# Altium schematic sheet RC4558_2021-03-31.schdoc
size 243 x 219 mm
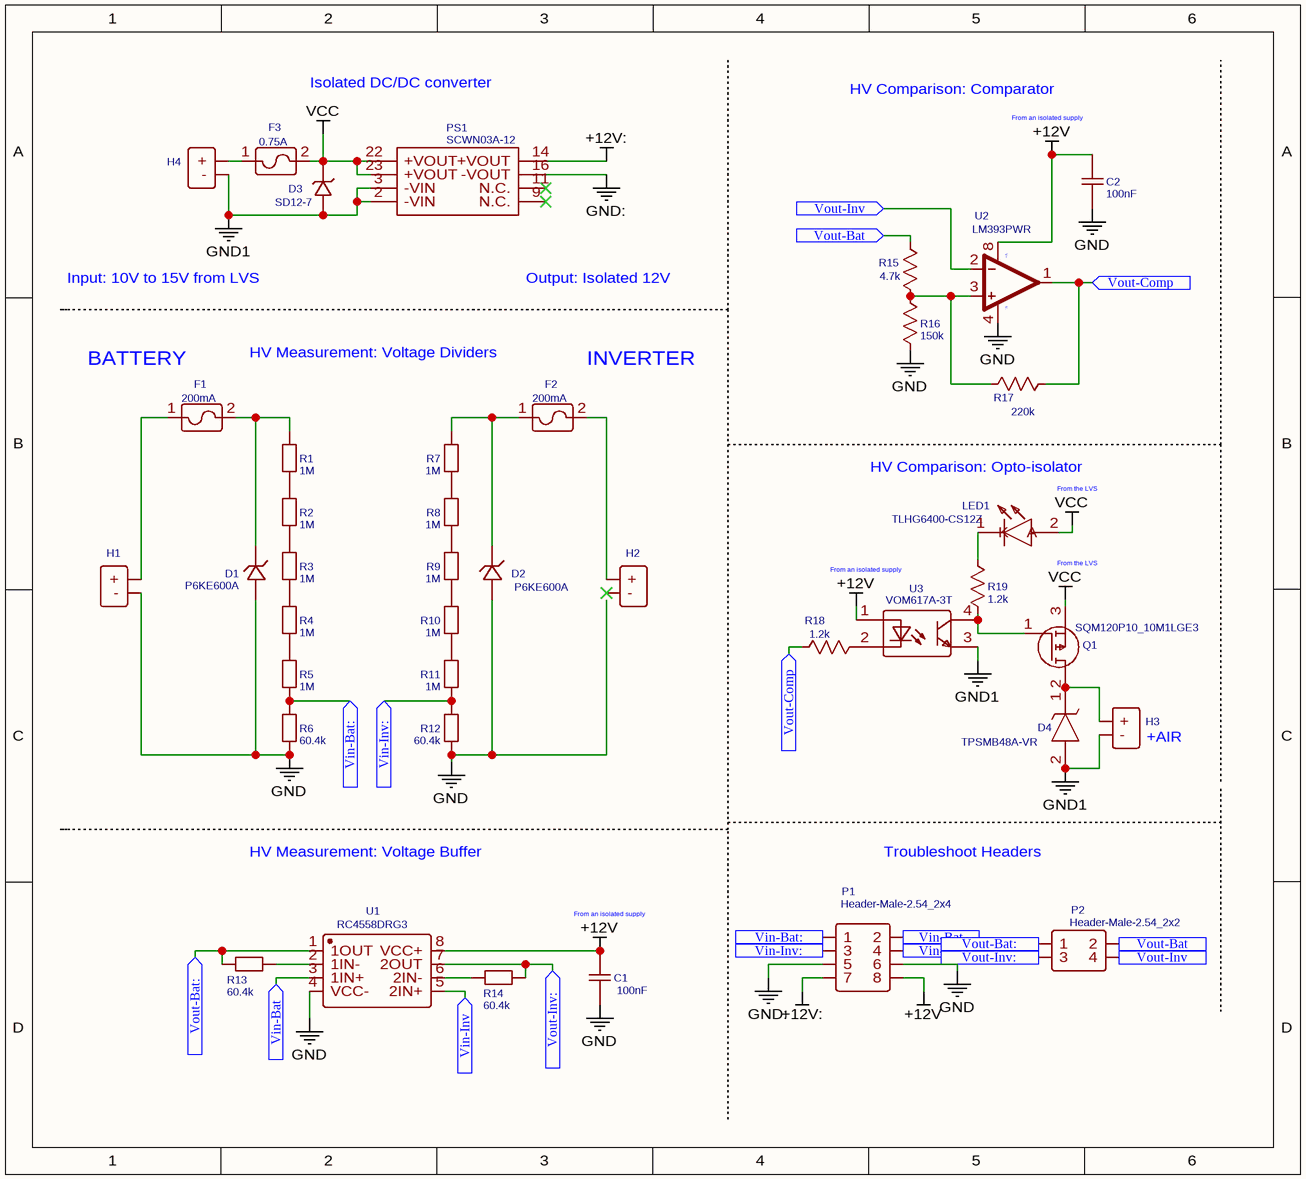
[diagram p0: RC4558_2021-03-31.schdoc]

## Parts
C1  100nF  [CAPC3216X94N]
C2  100nF  [CAPC3216X94N]
D1  P6KE600A  [DO-15_BD3.1-L6.7-P10.70-D0.9-RD]
D2  P6KE600A  [DO-15_BD3.1-L6.7-P10.70-D0.9-RD]
D3  SD12-7  [SOD-323_L1.8-W1.3-LS2.5-RD]
D4  TPSMB48A-VR  [DIONM5436X244N]
F1  200mA  [FUSE HOLDER]
F2  200mA  [FUSE HOLDER]
F3  0.75A  [2XFUSE_CLIP]
H1  1714971  [PHOENIX CONNECT 1714971 TERMINAL 2 POS]  (value not drawn)
H2  1714971  [PHOENIX CONNECT 1714971 TERMINAL 2 POS]  (value not drawn)
H3  1714971  [PHOENIX CONNECT 1714971 TERMINAL 2 POS]  (value not drawn)
H4  1714971  [PHOENIX CONNECT 1714971 TERMINAL 2 POS]  (value not drawn)
LED1  TLHG6400-CS12Z  [TLHG5400]
P1  Header-Male-2.54_2x4  [HDR-TH_8P-P2.54-V-M-R2-C4-S2.54]
P2  Header-Male-2.54_2x2  [HDR-TH_4P-P2.54-V-R2-C2-S2.54]
PS1  SCWN03A-12  [SCWN03A-12]
Q1  SQM120P10_10M1LGE3  [SQM120P10_10M1LGE3]
R1  1M  [RESC3216X70N]
R2  1M  [RESC3216X70N]
R3  1M  [RESC3216X70N]
R4  1M  [RESC3216X70N]
R5  1M  [RESC3216X70N]
R6  60.4k  [RESC3216X70N]
R7  1M  [RESC3216X70N]
R8  1M  [RESC3216X70N]
R9  1M  [RESC3216X70N]
R10  1M  [RESC3216X70N]
R11  1M  [RESC3216X70N]
R12  60.4k  [RESC3216X70N]
R13  60.4k  [RESC3216X70N]
R14  60.4k  [RESC3216X70N]
R15  4.7k  [RESC3216X70N]
R16  150k  [RESC3216X70N]
R17  220k  [RESC3216X70N]
R18  1.2k  [RESC3216X60N]
R19  1.2k  [RESC3116X70N]
U1  RC4558DRG3  [SOIC127P600X175-8N]
U2  LM393PWR  [SOP65P640X120-8N]
U3  VOM617A-3T  [VOM617A8X001T]

## Ports
Vin-Bat (in), Vin-Bat: (in), Vin-Inv (in), Vin-Inv: (in), Vout-Bat (in), Vout-Bat: (in), Vout-Comp (in), Vout-Inv (in), Vout-Inv: (in)

## Nets
+12V: C1.2 C2.1 P1.8 U1.8(VCC+) U2.8(V+) U3.1(AN)
+12V:: P1.7 PS1.14(+VOUT)
GND: C1.1 C2.2 D1.2 D2.2 H1.1(-) P1.6 R6.1 R12.1 R16.1 U1.4(VCC-) U2.4(V-)
GND1: D3.2 D4.2(A) H3.2(-) H4.1(-) PS1.2(-VIN) PS1.3(-VIN) U3.3(EM)
GND:: P1.5 PS1.16(-VOUT)
VCC: D3.1 F3.2 LED1.2(A) PS1.22(+VOUT) PS1.23(+VOUT) Q1.3(S)
Vin-Bat: P1.2 U1.3(1IN+) ; port Vin-Bat
Vin-Bat:: P1.1 R5.1 R6.2 ; port Vin-Bat:
Vin-Inv: P1.4 U1.5(2IN+) ; port Vin-Inv
Vin-Inv:: P1.3 R11.1 R12.2 ; port Vin-Inv:
Vout-Bat: P2.2 R15.2 ; port Vout-Bat
Vout-Bat:: P2.1 R13.2 U1.1(1OUT) ; port Vout-Bat:
Vout-Comp: R17.2 R18.1 U2.1(OUT) ; port Vout-Comp
Vout-Inv: P2.4 U2.2(-IN) ; port Vout-Inv
Vout-Inv:: P2.3 R14.1 U1.7(2OUT) ; port Vout-Inv:
NetD1_1: D1.1 F1.2 R1.2
NetD2_1: D2.1 F2.1 R7.2
NetD4_1: D4.1(K) H3.1(+) Q1.2(D)
NetF1_1: F1.1 H1.2(+)
NetF2_2: F2.2 H2.1(+)
NetF3_1: F3.1 H4.2(+)
NetLED1_1: LED1.1(K) R19.2
NetQ1_1: Q1.1(G) R19.1 U3.4(COL)
NetR1_1: R1.1 R2.2
NetR2_1: R2.1 R3.2
NetR3_1: R3.1 R4.2
NetR4_1: R4.1 R5.2
NetR7_1: R7.1 R8.2
NetR8_1: R8.1 R9.2
NetR9_1: R9.1 R10.2
NetR10_1: R10.1 R11.2
NetR13_1: R13.1 U1.2(1IN-)
NetR14_2: R14.2 U1.6(2IN-)
NetR15_1: R15.1 R16.2 R17.1 U2.3(+IN)
NetR18_2: R18.2 U3.2(CAT)

Not connected (* = marked no-connect by the designer): H2 2(-)*; PS1 9(N.C.)* 11(N.C.)*

## Notes on the sheet
- Isolated DC/DC converter
- HV Comparison: Comparator
- (near C2) From an isolated supply
- Input: 10V to 15V from LVS
- Output: Isolated 12V
- BATTERY
- HV Measurement: Voltage Dividers
- (near F2) INVERTER
- HV Comparison: Opto-isolator
- (near LED1) From the LVS
- (near U3) From an isolated supply
- From the LVS
- (near H3) +AIR
- HV Measurement: Voltage Buffer
- Troubleshoot Headers
- (near C1) From an isolated supply

## Library data of the parts
C1 C2 = 100nF: BOM_Manufacturer: AVX; BOM_Manufacturer Part: 12065C104KAT2A; nameAlias: Capacitance; Contributor: LCSC; BOM_Supplier: LCSC; BOM_Supplier Part: C167342; spicePre: C; spiceSymbolName: 12065C104KAT2A
D1 D2 = P6KE600A: BOM_Manufacturer: DOWO; Contributor: LCSC; BOM_Supplier: LCSC; BOM_Supplier Part: C294171; BOM_Manufacturer Part: P6KE600A; spicePre: D; spiceSymbolName: P6KE600A
D3 = SD12-7: BOM_Manufacturer: Diodes Incorporated; Contributor: LCSC; BOM_Supplier: LCSC; BOM_Supplier Part: C526760; BOM_Manufacturer Part: SD12-7; spicePre: D; spiceSymbolName: SD12-7
F1 F2 = 200mA: Contributor: richardkaiva1; spicePre: U; spiceSymbolName: Fuse Holder
F3 = 0.75A: Contributor: richardkaiva1; spicePre: U; spiceSymbolName: fuse holder2
H1-H4 = 1714971: Contributor: LCEDA_Lib; BOM_Supplier Part: C49661; BOM_Supplier: LCSC; spicePre: H; spiceSymbolName: HDR-F-2.54_1x2
LED1 = TLHG6400-CS12Z: Contributor: kfarmijo; spicePre: L; spiceSymbolName: TLHG6400-CS12Z
P1 = Header-Male-2.54_2x4: BOM_Manufacturer: ReliaPro; BOM_Manufacturer Part: Header2X4P 2.54mm; BOM_Supplier: LCSC; image: http://image.lceda.cn/szlcsc/C58363.jpg; BOM_Supplier Part: C58363; spicePre: P; spiceSymbolName: Header-Male-2.54_2x4
P2 = Header-Male-2.54_2x2: BOM_Manufacturer: BOOMELE; BOM_Manufacturer Part: Double Rows2.54mm2*2pHeaders  Pins; BOM_Supplier: LCSC; BOM_Supplier Part: C66690; spicePre: P; spiceSymbolName: Header-Male-2.54_2x2
PS1 = SCWN03A-12: Contributor: Dimitriy Georgiev; spicePre: P; spiceSymbolName: SCWN03A-12
Q1 = SQM120P10_10M1LGE3: Contributor: ramil7; spicePre: Q; spiceSymbolName: SQM120P10_10M1LGE3
R1 = 1M: nameAlias: Value(Ω); Contributor: LCEDA_Lib; Package Display: No; spicePre: R; spiceSymbolName: R_0603_EU
R2-R5 R7-R11 = 1M: nameAlias: Value(Ω); Contributor: LCEDA_Lib; spicePre: R; spiceSymbolName: R_0603_EU
R6 R12-R14 = 60.4k: nameAlias: Value(Ω); Contributor: LCEDA_Lib; spicePre: R; spiceSymbolName: R_0603_EU
R15 = 4.7k: nameAlias: Value(Ω); Contributor: LCEDA_Lib; spicePre: R; spiceSymbolName: R_0603_US
R16 = 150k: nameAlias: Value(Ω); Contributor: LCEDA_Lib; spicePre: R; spiceSymbolName: R_0603_US
R17 = 220k: nameAlias: Value(Ω); Contributor: LCEDA_Lib; spicePre: R; spiceSymbolName: R_0603_US
R18 R19 = 1.2k: nameAlias: Value(Ω); Contributor: LCEDA_Lib; spicePre: R; spiceSymbolName: R_0603_US
U2 = LM393PWR: subpart_no: 1; Contributor: SparkFun; spicePre: U; spiceSymbolName: LM393
U3 = VOM617A-3T: BOM_Manufacturer: SHARP; BOM_Manufacturer Part: PC817X3NIP0F(C ); BOM_Supplier: LCSC; BOM_Supplier Part: C95782; spicePre: U; spiceSymbolName: PC817X3NIP0F(C )
D4 = TPSMB48A-VR: spicePre: D; spiceSymbolName: SMBJ28CAHE3_A_H
U1 = RC4558DRG3: spicePre: X; spiceSymbolName: RC4558DRG3